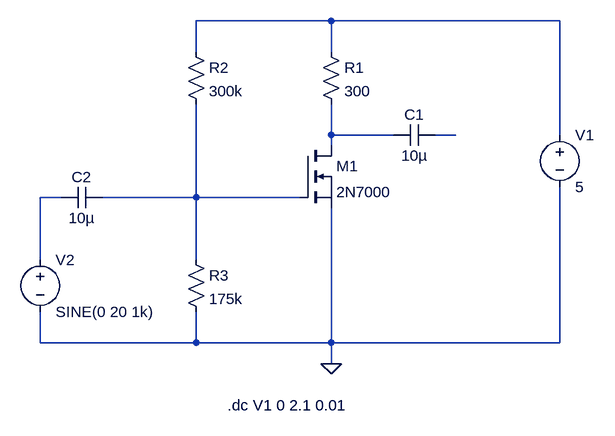
[diagram p0: schematic 3.asc]
3.asc, the LTspice schematic file:
Version 4
SHEET 1 880 680
WIRE 192 -32 -16 -32
WIRE 544 -32 192 -32
WIRE -16 16 -16 -32
WIRE 192 16 192 -32
WIRE 192 144 192 96
WIRE 288 144 192 144
WIRE 384 144 352 144
WIRE 544 144 544 -32
WIRE 192 160 192 144
WIRE -224 240 -256 240
WIRE -16 240 -16 96
WIRE -16 240 -160 240
WIRE 144 240 -16 240
WIRE -256 336 -256 240
WIRE -16 336 -16 240
WIRE -256 464 -256 416
WIRE -16 464 -16 416
WIRE -16 464 -256 464
WIRE 192 464 192 256
WIRE 192 464 -16 464
WIRE 544 464 544 224
WIRE 544 464 192 464
WIRE 192 496 192 464
FLAG 192 496 0
SYMBOL nmos 144 160 R0
SYMATTR InstName M1
SYMATTR Value 2N7000
SYMBOL voltage 544 128 R0
WINDOW 123 0 0 Left 2
WINDOW 39 0 0 Left 2
SYMATTR InstName V1
SYMATTR Value 5
SYMBOL res 176 0 R0
SYMATTR InstName R1
SYMATTR Value 300
SYMBOL res -32 0 R0
SYMATTR InstName R2
SYMATTR Value 300k
SYMBOL res -32 320 R0
SYMATTR InstName R3
SYMATTR Value 175k
SYMBOL cap 352 128 R90
WINDOW 0 0 32 VBottom 2
WINDOW 3 32 32 VTop 2
SYMATTR InstName C1
SYMATTR Value 10µ
SYMBOL cap -160 224 R90
WINDOW 0 0 32 VBottom 2
WINDOW 3 32 32 VTop 2
SYMATTR InstName C2
SYMATTR Value 10µ
SYMBOL voltage -256 320 R0
WINDOW 123 0 0 Left 2
WINDOW 39 0 0 Left 2
SYMATTR InstName V2
SYMATTR Value SINE(0 20 1k)
TEXT 32 560 Left 2 !.dc V1 0 2.1 0.01

The netlist it stands for:
* 3.asc
M1 N002 N005 0 0 2N7000
V1 N001 0 5
R1 N001 N002 300
R2 N001 N005 300k
R3 N005 0 175k
C1 N003 N002 10µ
C2 N005 N004 10µ
V2 N004 0 SINE(0 20 1k)
.model NMOS NMOS
.model PMOS PMOS
.lib standard.mos
.dc V1 0 2.1 0.01
.backanno
.end